# Altium schematic sheet subckt_level_shifter.SchDoc
size A
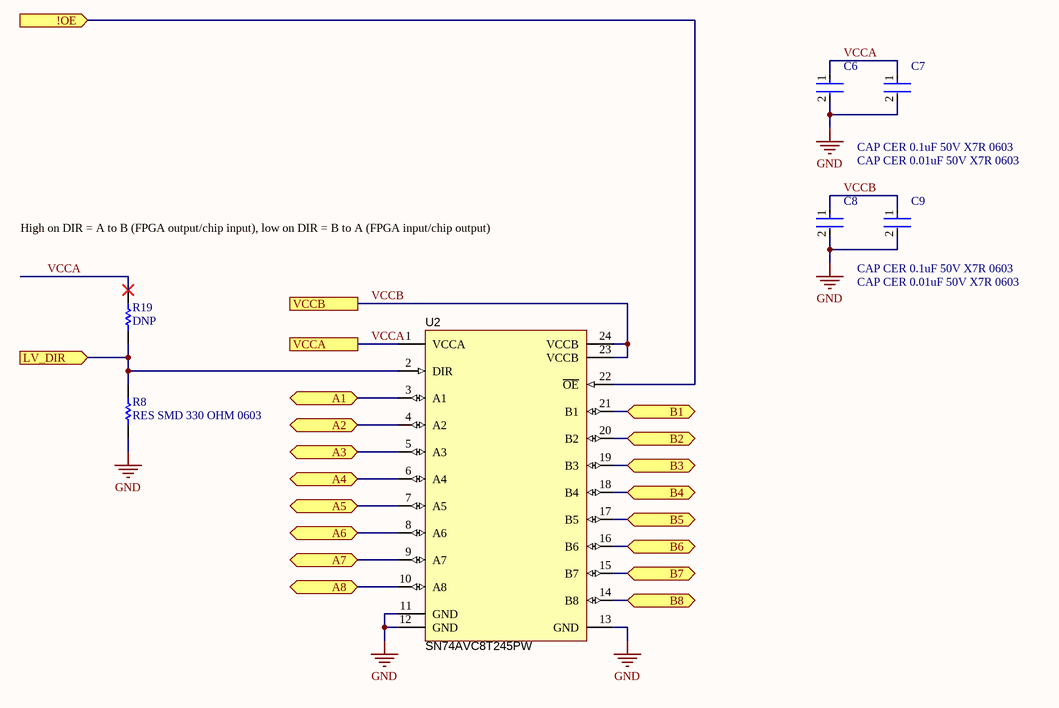
[diagram p0: subckt_level_shifter.SchDoc]

## Parts
C6  CAP CER 0.1uF 50V X7R 0603  [FP-CC0603-DA-MFG]
C7  CAP CER 0.01uF 50V X7R 0603  [FP-CC0603-DA-MFG]
C8  CAP CER 0.1uF 50V X7R 0603  [FP-CC0603-DA-MFG]
C9  CAP CER 0.01uF 50V X7R 0603  [FP-CC0603-DA-MFG]
R8  RES SMD 330 OHM 0603  [RESC1609X50X30LL10T20]
R19  DNP  [RESC1609X50X30LL10T20]
U2  SN74AVC8T245PW  [PW0024A_N]

## Ports
!OE (in), A1 (bidir), A2 (bidir), A3 (bidir), A4 (bidir), A5 (bidir), A6 (bidir), A7 (bidir), A8 (bidir), B1 (bidir), B2 (bidir), B3 (bidir), B4 (bidir), B5 (bidir), B6 (bidir), B7 (bidir), B8 (bidir), LV_DIR (in), VCCA, VCCB

## Nets
GND: C6.2 C7.2 C8.2 C9.2 R8.2 U2.11(GND) U2.12(GND) U2.13(GND)
!OE: U2.22(~{OE}) ; port !OE
A1: U2.3(A1) ; port A1
A2: U2.4(A2) ; port A2
A3: U2.5(A3) ; port A3
A4: U2.6(A4) ; port A4
A5: U2.7(A5) ; port A5
A6: U2.8(A6) ; port A6
A7: U2.9(A7) ; port A7
A8: U2.10(A8) ; port A8
B1: U2.21(B1) ; port B1
B2: U2.20(B2) ; port B2
B3: U2.19(B3) ; port B3
B4: U2.18(B4) ; port B4
B5: U2.17(B5) ; port B5
B6: U2.16(B6) ; port B6
B7: U2.15(B7) ; port B7
B8: U2.14(B8) ; port B8
LV_DIR: R8.1 R19.2 U2.2(DIR) ; port LV_DIR
VCCA: C6.1 C7.1 R19.1 U2.1(VCCA) ; port VCCA
VCCB: C8.1 C9.1 U2.23(VCCB) U2.24(VCCB) ; port VCCB

## Notes on the sheet
- High on DIR = A to B (FPGA output/chip input), low on DIR = B to A (FPGA input/chip output)

## Library data of the parts
C6-C9 = CMP-03422-000030-1: Manufacturer Part Number: CC0603KRX7R7BB104; Manufacturer: YAGEO; Voltage Rating: 16 V; Tolerance: 0.1; Value: 100 nF; Temperature Coefficient: 15%; Material: Ceramic; Package: CC0603-DA; ComponentLink2Description: Datasheet; Octopart: https://octopart.com/cc0603krx7r7bb104-yageo-192941; Temperature Range High: +125°C; Digikey Description: CAP CER 0.1UF 16V X7R 0603; Voltage: 16 V; Device Class L2: Capacitors; Height: 0.9mm; Temperature: -55°C to +125°C; Device Class L1: Passive Components; Device Class L3: Ceramic Capacitors; ComponentLink2URL: http://www.yageo.com/documents/recent/UPY-GPHC_X7R_6.3V-to-50V_18.pdf; Footprint Url: http://www.yageo.com/exep/pages/download/literatures/UPY-C_GEN_24.pdf; RoHS: TRUE; Temperature Range Low: -55°C; Temperature Characteristic: X7R; Lead Free: Yes; Capacitance: 100 nF; Category: Cap; Mouser Description: Multilayer Ceramic Capacitor, CC Series, 0.1 - F, - 10%, X7R, 16 V, 0603 [1608 Metric]; Automotive: No
R8 R19 = CMP-2000-03820-1: Part Number: CRCW0603100KFKEA; Manufacturer: Vishay Dale
U2 = SN74AVC8T245PW: 8-BIT DUAL-SUPPLY BUS TRANSCEIVER WITH CONFIGURABLE VOLTAGE TRANSLATION AND 3-STATE OUTPUTS, PW0024A; Alternate Manufacturer: None; Manufacturer: Texas Instruments; SymbolCreator: a0411947; CompType: IC; U/M: EA; SymbolVersion: 2014-02-27; PartNumber: SN74AVC8T245PW; PackageReference: PW0024A; MountType: SMT; ComponentLink1Description: Datasheet Link; ComponentLink1URL: http://www.ti.com/lit/ds/symlink/sn74avc8t245.pdf; RoHS: Y; Publisher: Texas Instruments; LatestRevisionDate: 2014-03-31